# EAGLE design AnemometerTHT (EAGLE 9.6.2)

## Sheet 1 of 4: microcontroller
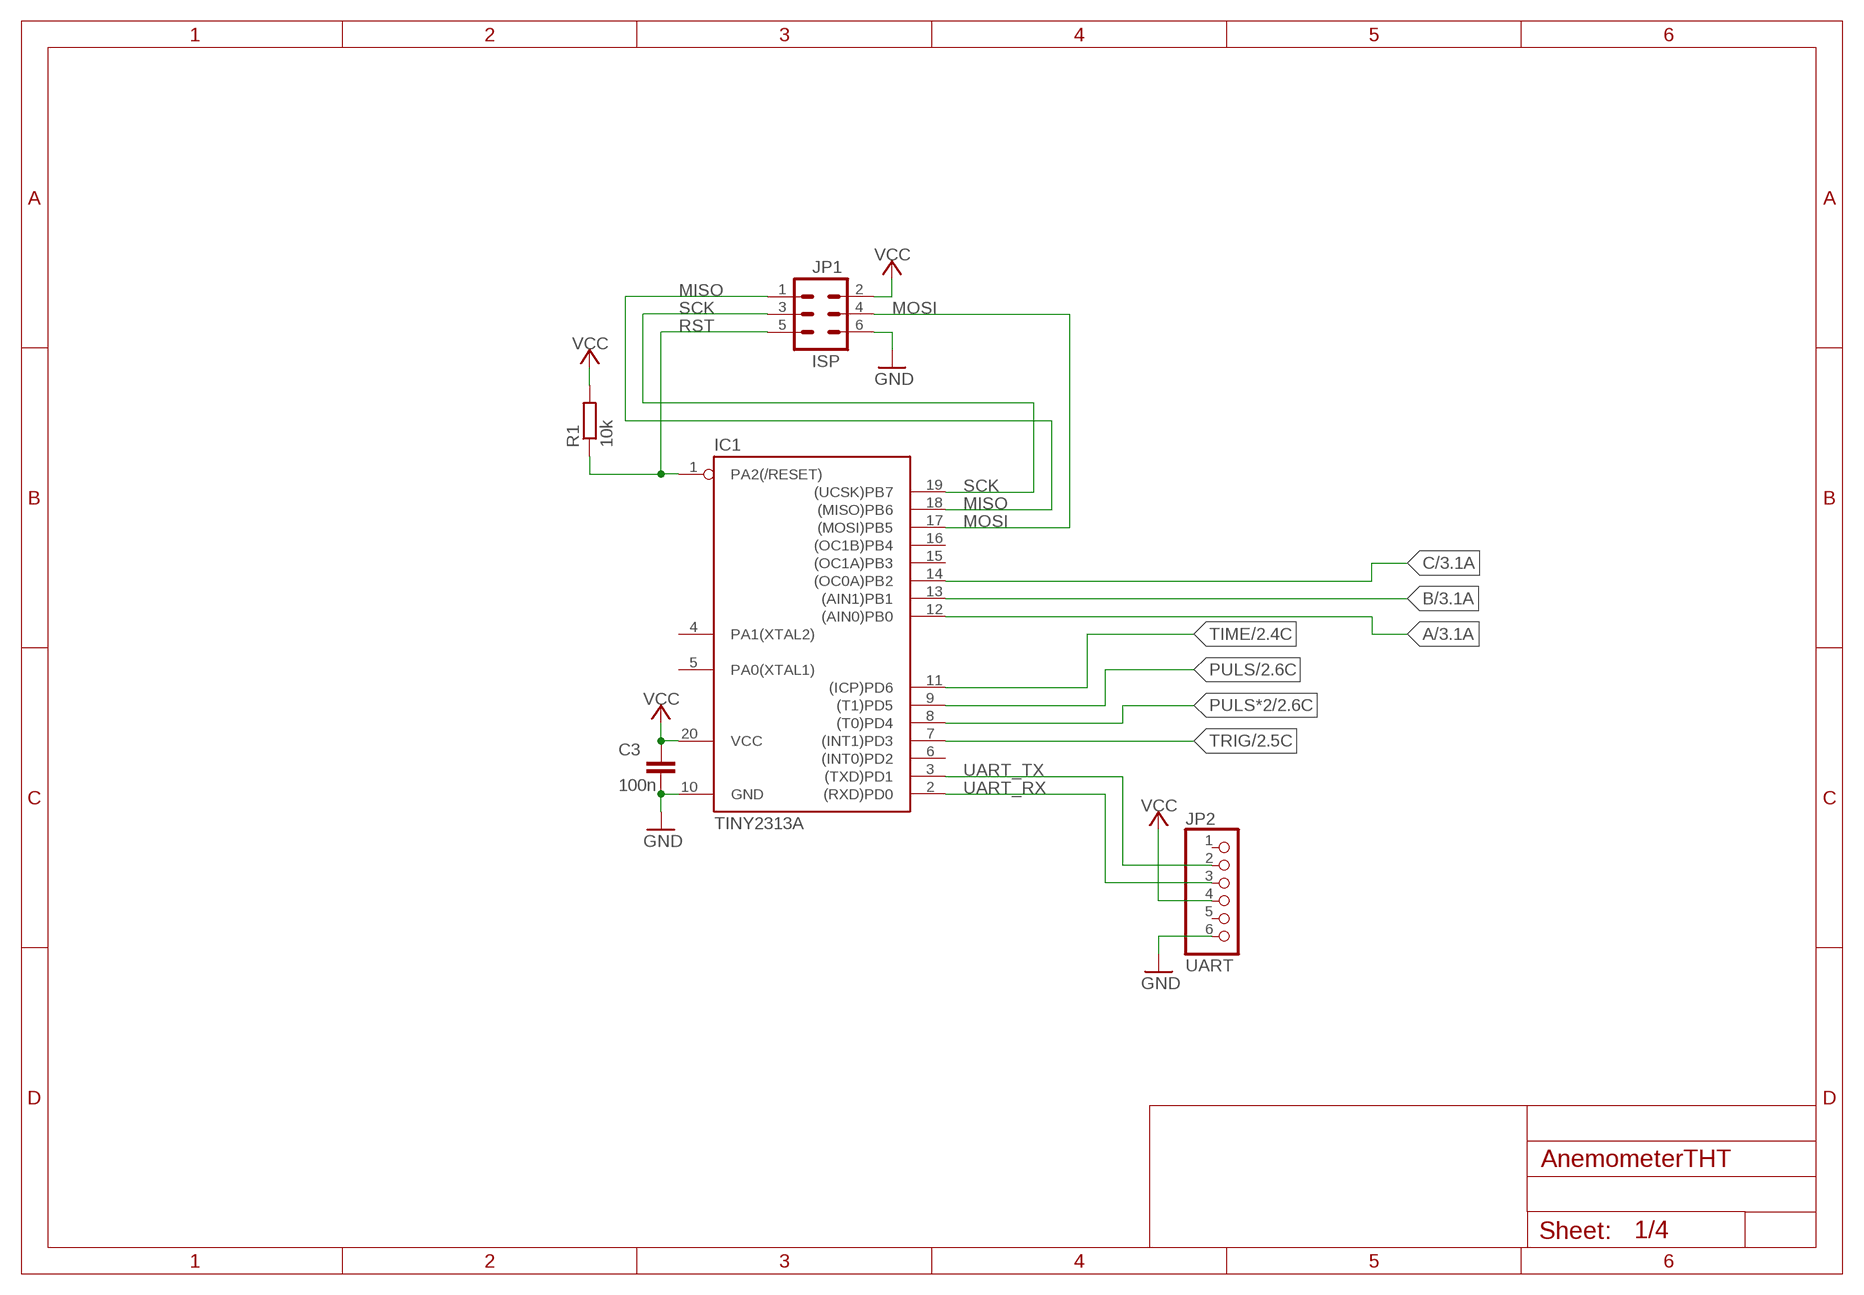
[diagram p0: schematic, sheet 1]

### Parts
C3  100n  C-EU050-030X075  [C050-030X075]
IC1  TINY2313A  TINY2313-*P*  [DIL20]
JP1  ISP  ML6  [ML6]
JP2  UART  PINHD-1X6  [1X06]
R1  10k  R-EU_0204/7  [0204/7]

### Nets
A: IC1.12((AIN0)PB0) ; also sheet 3
B: IC1.13((AIN1)PB1) ; also sheet 3
C: IC1.14((OC0A)PB2) ; also sheet 3
GND: C3.2 IC1.10(GND) JP1.6 JP2.6 ; also sheet 2,3,4
MISO: IC1.18((MISO)PB6) JP1.1
MOSI: IC1.17((MOSI)PB5) JP1.4
PULS: IC1.9((T1)PD5) ; also sheet 2
PULS*2: IC1.8((T0)PD4) ; also sheet 2
RST: IC1.1(PA2(/RESET)) JP1.5 R1.1
SCK: IC1.19((UCSK)PB7) JP1.3
TIME: IC1.11((ICP)PD6) ; also sheet 2
TRIG: IC1.7((INT1)PD3) ; also sheet 2,3
UART_RX: IC1.2((RXD)PD0) JP2.3
UART_TX: IC1.3((TXD)PD1) JP2.2
VCC: C3.1 IC1.20(VCC) JP1.2 JP2.4 R1.2 ; also sheet 2,3,4
Unconnected: IC1.4(PA1(XTAL2)) IC1.5(PA0(XTAL1)) IC1.6((INT0)PD2) IC1.15((OC1A)PB3) IC1.16((OC1B)PB4) JP2.1 JP2.5

## Sheet 2 of 4: puls generation
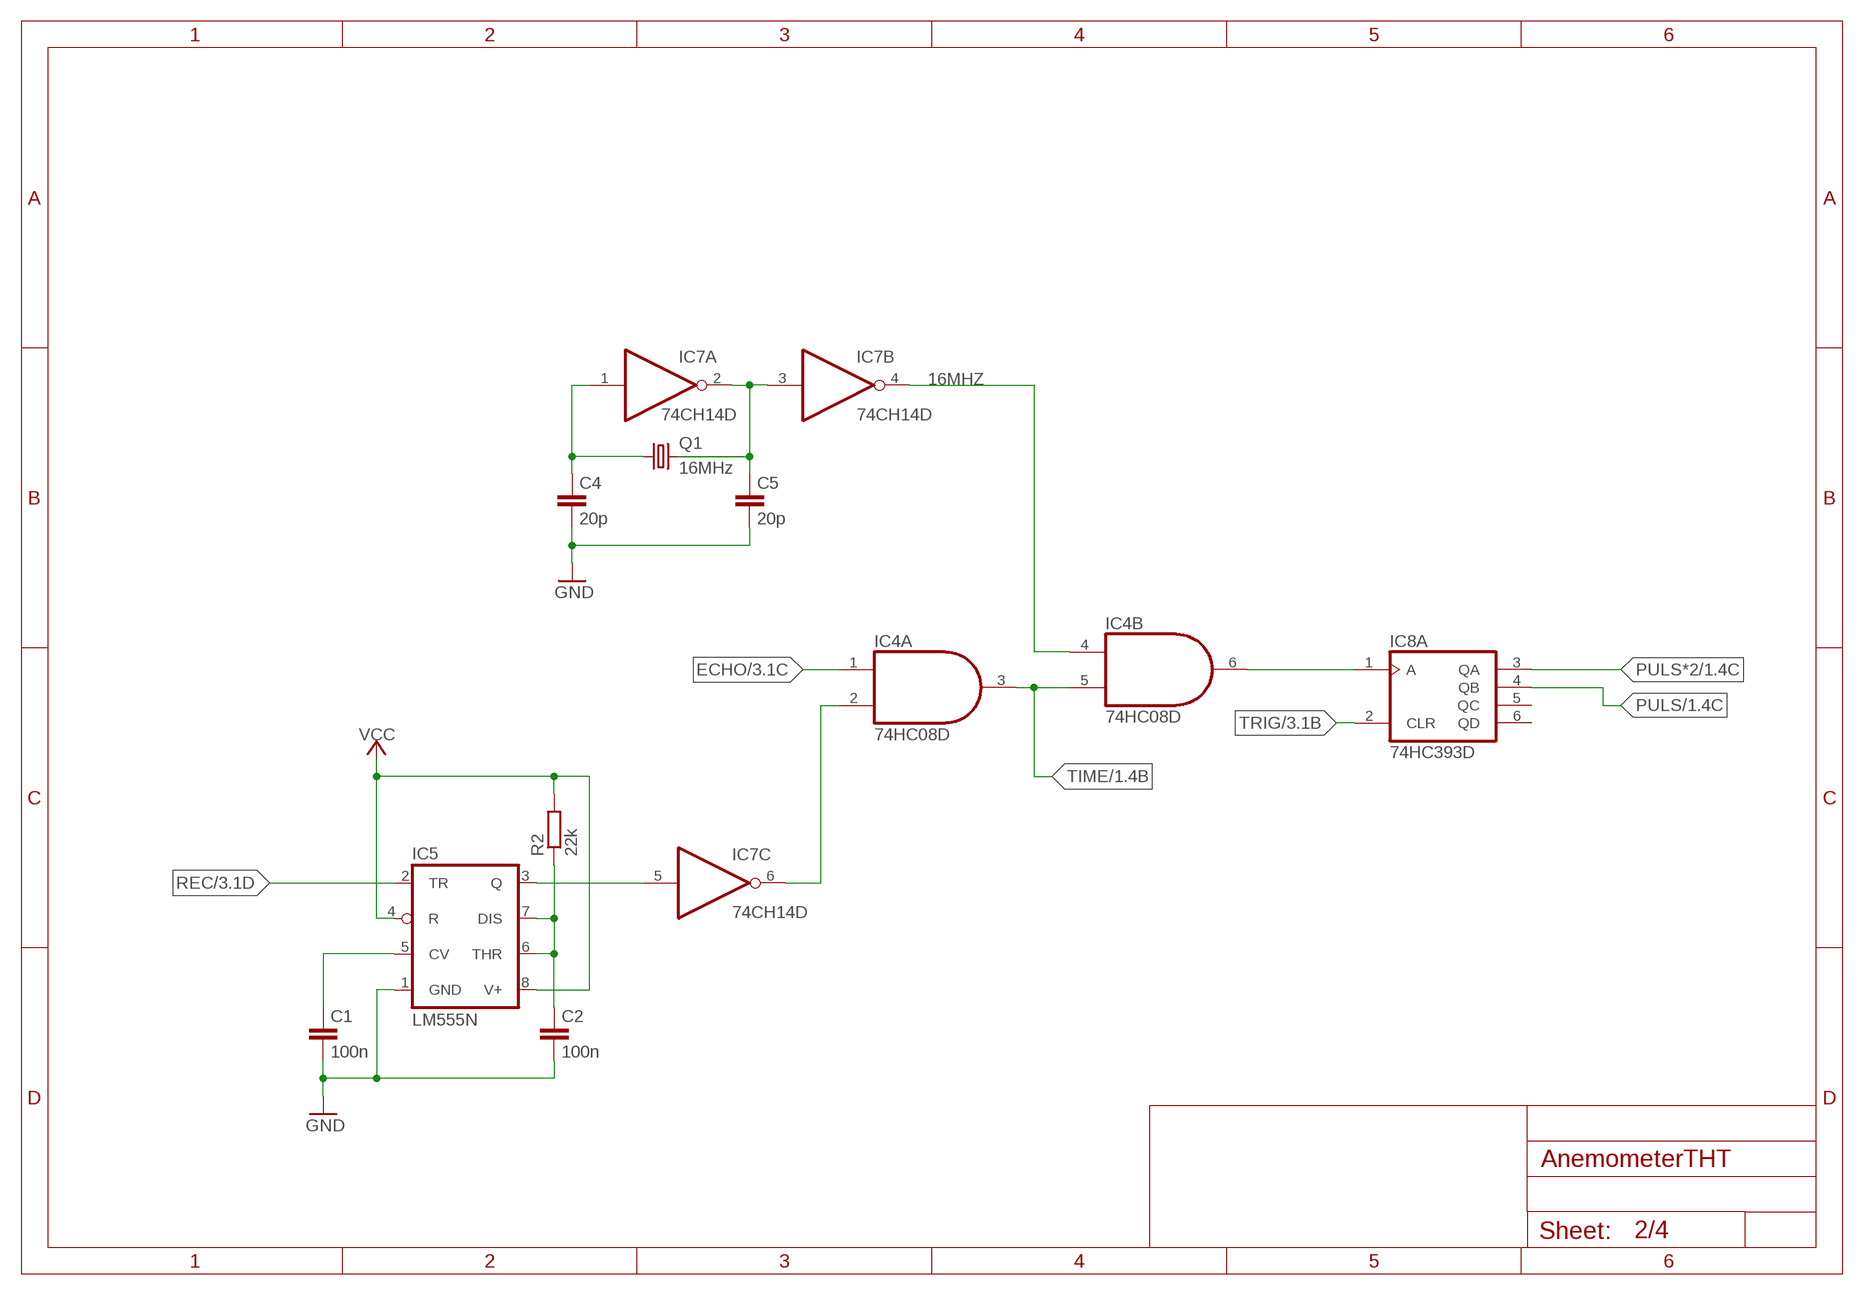
[diagram p1: schematic, sheet 2]

### Parts
C1  100n  C-EU050-030X075  [C050-030X075]
C2  100n  C-EU050-030X075  [C050-030X075]
C4  20p  C-EU050-030X075  [C050-030X075]
C5  20p  C-EU050-030X075  [C050-030X075]
IC4  74HC08D  74ALS08N  [DIL14]
IC5  LM555N  [DIL08]
IC7  74CH14D  74ALS04N  [DIL14]
IC8  74HC393D  74LS393N  [DIL14]
Q1  16MHz  CRYSTALHC49U70  [HC49U70]
R2  22k  R-EU_0204/7  [0204/7]

### Nets
16MHZ: IC4.4(B:I0) IC7.4(B:O)
ECHO: IC4.1(A:I0) ; also sheet 3
GND: C1.2 C2.2 C4.2 C5.2 IC5.1(GND) ; also sheet 1,3,4
N$1: IC5.3(Q) IC7.5(C:I)
N$2: C1.1 IC5.5(CV)
N$3: IC4.6(B:O) IC8.1(A:A)
N$4: C2.1 IC5.6(THR) IC5.7(DIS) R2.1
N$5: IC4.2(A:I1) IC7.6(C:O)
N$6: C4.1 IC7.1(A:I) Q1.1
N$7: C5.1 IC7.2(A:O) IC7.3(B:I) Q1.2
PULS: IC8.4(A:QB) ; also sheet 1
PULS*2: IC8.3(A:QA) ; also sheet 1
REC: IC5.2(TR) ; also sheet 3
TIME: IC4.3(A:O) IC4.5(B:I1) ; also sheet 1
TRIG: IC8.2(A:CLR) ; also sheet 1,3
VCC: IC5.4(R) IC5.8(V+) R2.2 ; also sheet 1,3,4
Unconnected: IC8.5(A:QC) IC8.6(A:QD)

## Sheet 3 of 4: multiplexer
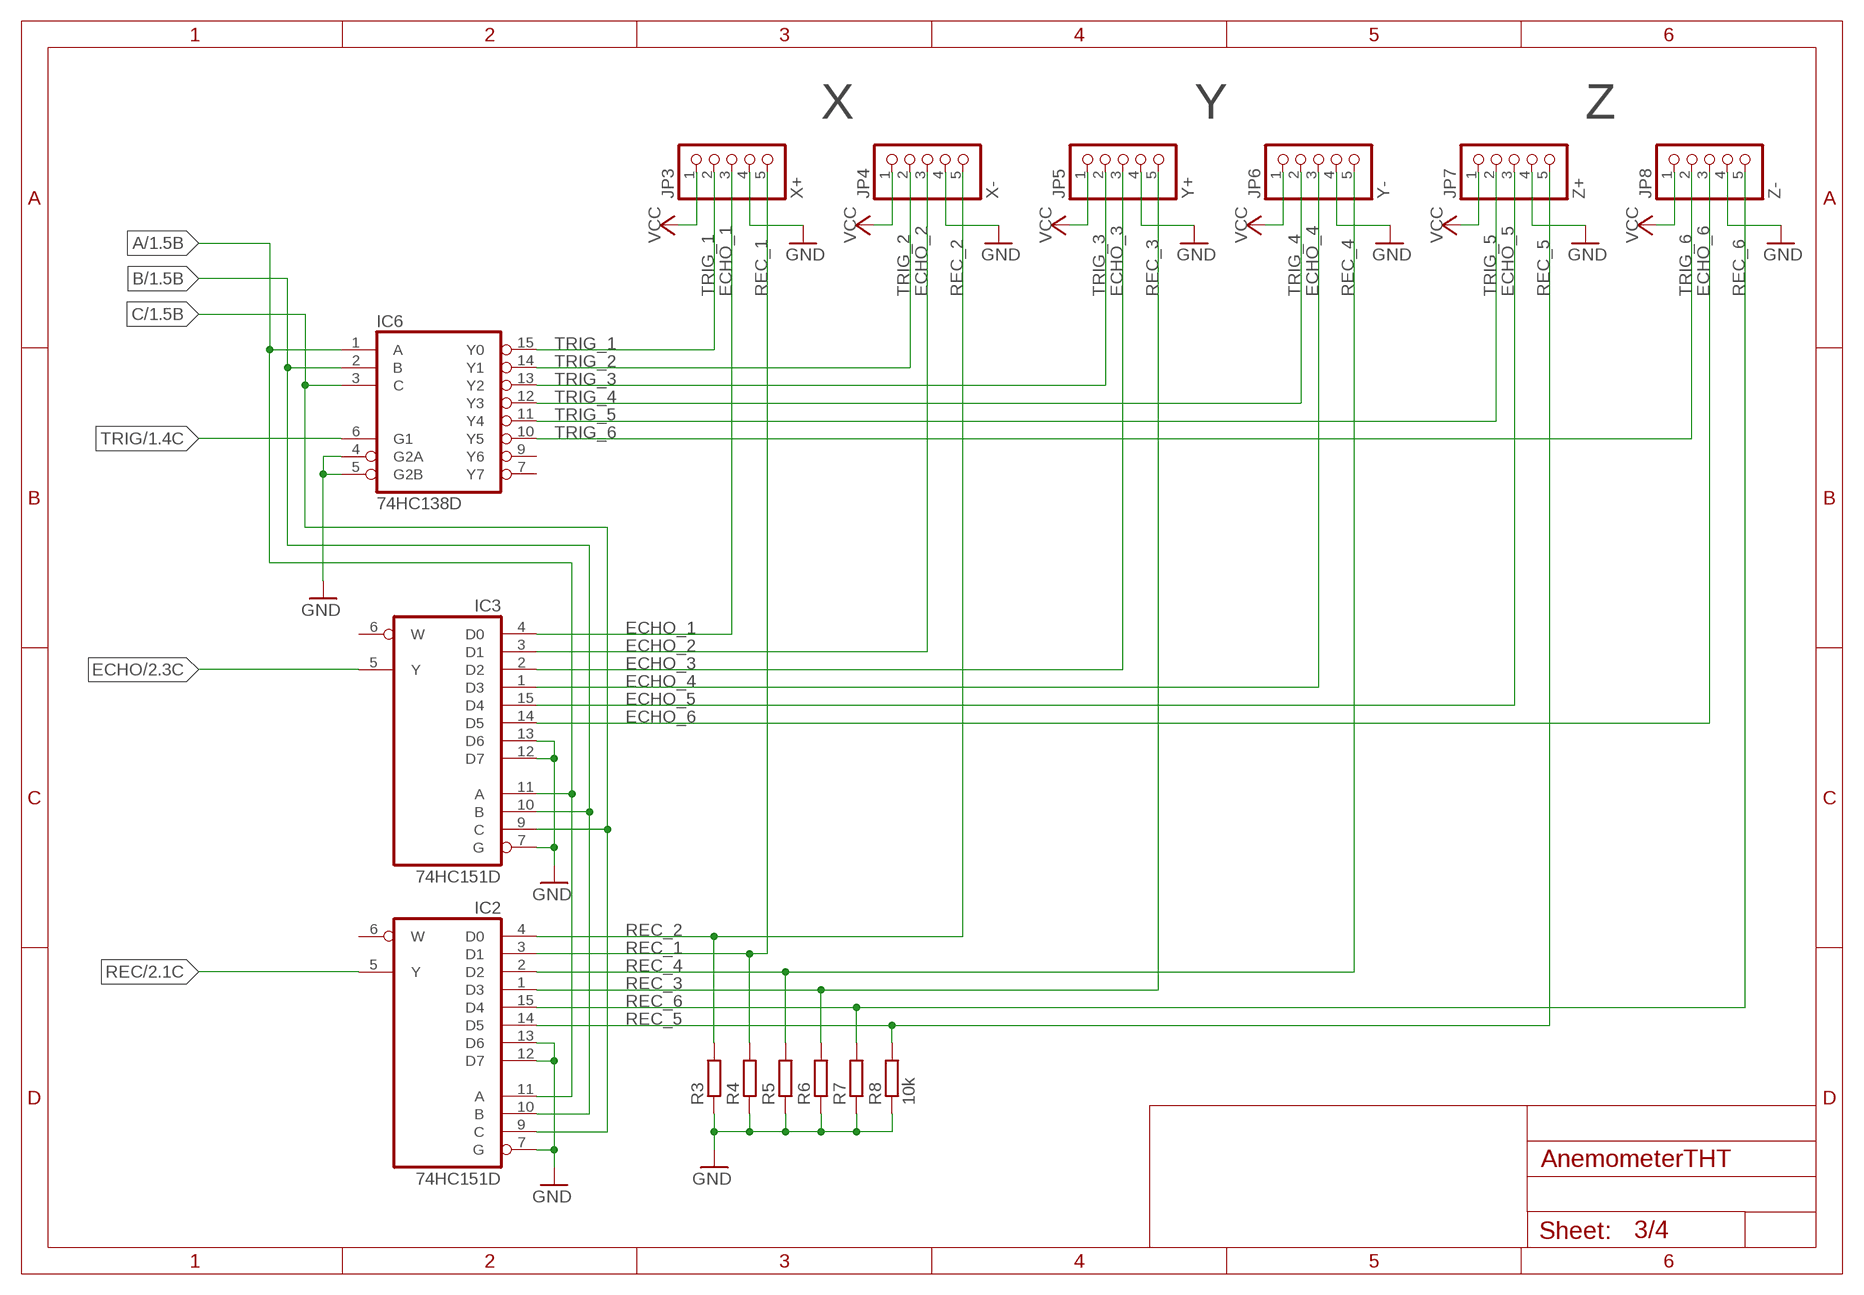
[diagram p2: schematic, sheet 3]

### Parts
IC2  74HC151D  74LS151N  [DIL16]
IC3  74HC151D  74LS151N  [DIL16]
IC6  74HC138D  74LS138N  [DIL16]
JP3  X+  PINHD-1X5  [1X05]
JP4  X-  PINHD-1X5  [1X05]
JP5  Y+  PINHD-1X5  [1X05]
JP6  Y-  PINHD-1X5  [1X05]
JP7  Z+  PINHD-1X5  [1X05]
JP8  Z-  PINHD-1X5  [1X05]
R3  10k  R-EU_0204/7  [0204/7]
R4  10k  R-EU_0204/7  [0204/7]
R5  10k  R-EU_0204/7  [0204/7]
R6  10k  R-EU_0204/7  [0204/7]
R7  10k  R-EU_0204/7  [0204/7]
R8  10k  R-EU_0204/7  [0204/7]

### Nets
A: IC2.11(A) IC3.11(A) IC6.1(A) ; also sheet 1
B: IC2.10(B) IC3.10(B) IC6.2(B) ; also sheet 1
C: IC2.9(C) IC3.9(C) IC6.3(C) ; also sheet 1
ECHO: IC3.5(Y) ; also sheet 2
ECHO_1: IC3.4(D0) JP3.3
ECHO_2: IC3.3(D1) JP4.3
ECHO_3: IC3.2(D2) JP5.3
ECHO_4: IC3.1(D3) JP6.3
ECHO_5: IC3.15(D4) JP7.3
ECHO_6: IC3.14(D5) JP8.3
GND: IC2.7(G) IC2.12(D7) IC2.13(D6) IC3.7(G) IC3.12(D7) IC3.13(D6) IC6.4(G2A) IC6.5(G2B) JP3.4 JP4.4 JP5.4 JP6.4 JP7.4 JP8.4 R3.1 R4.1 R5.1 R6.1 R7.1 R8.1 ; also sheet 1,2,4
REC: IC2.5(Y) ; also sheet 2
REC_1: IC2.3(D1) JP3.5 R4.2
REC_2: IC2.4(D0) JP4.5 R3.2
REC_3: IC2.1(D3) JP5.5 R6.2
REC_4: IC2.2(D2) JP6.5 R5.2
REC_5: IC2.14(D5) JP7.5 R8.2
REC_6: IC2.15(D4) JP8.5 R7.2
TRIG: IC6.6(G1) ; also sheet 1,2
TRIG_1: IC6.15(Y0) JP3.2
TRIG_2: IC6.14(Y1) JP4.2
TRIG_3: IC6.13(Y2) JP5.2
TRIG_4: IC6.12(Y3) JP6.2
TRIG_5: IC6.11(Y4) JP7.2
TRIG_6: IC6.10(Y5) JP8.2
VCC: JP3.1 JP4.1 JP5.1 JP6.1 JP7.1 JP8.1 ; also sheet 1,2,4
Unconnected: IC2.6(W) IC3.6(W) IC6.7(Y7) IC6.9(Y6)

### Notes on the sheet
- X | Y | Z

## Sheet 4 of 4: power / unused gates
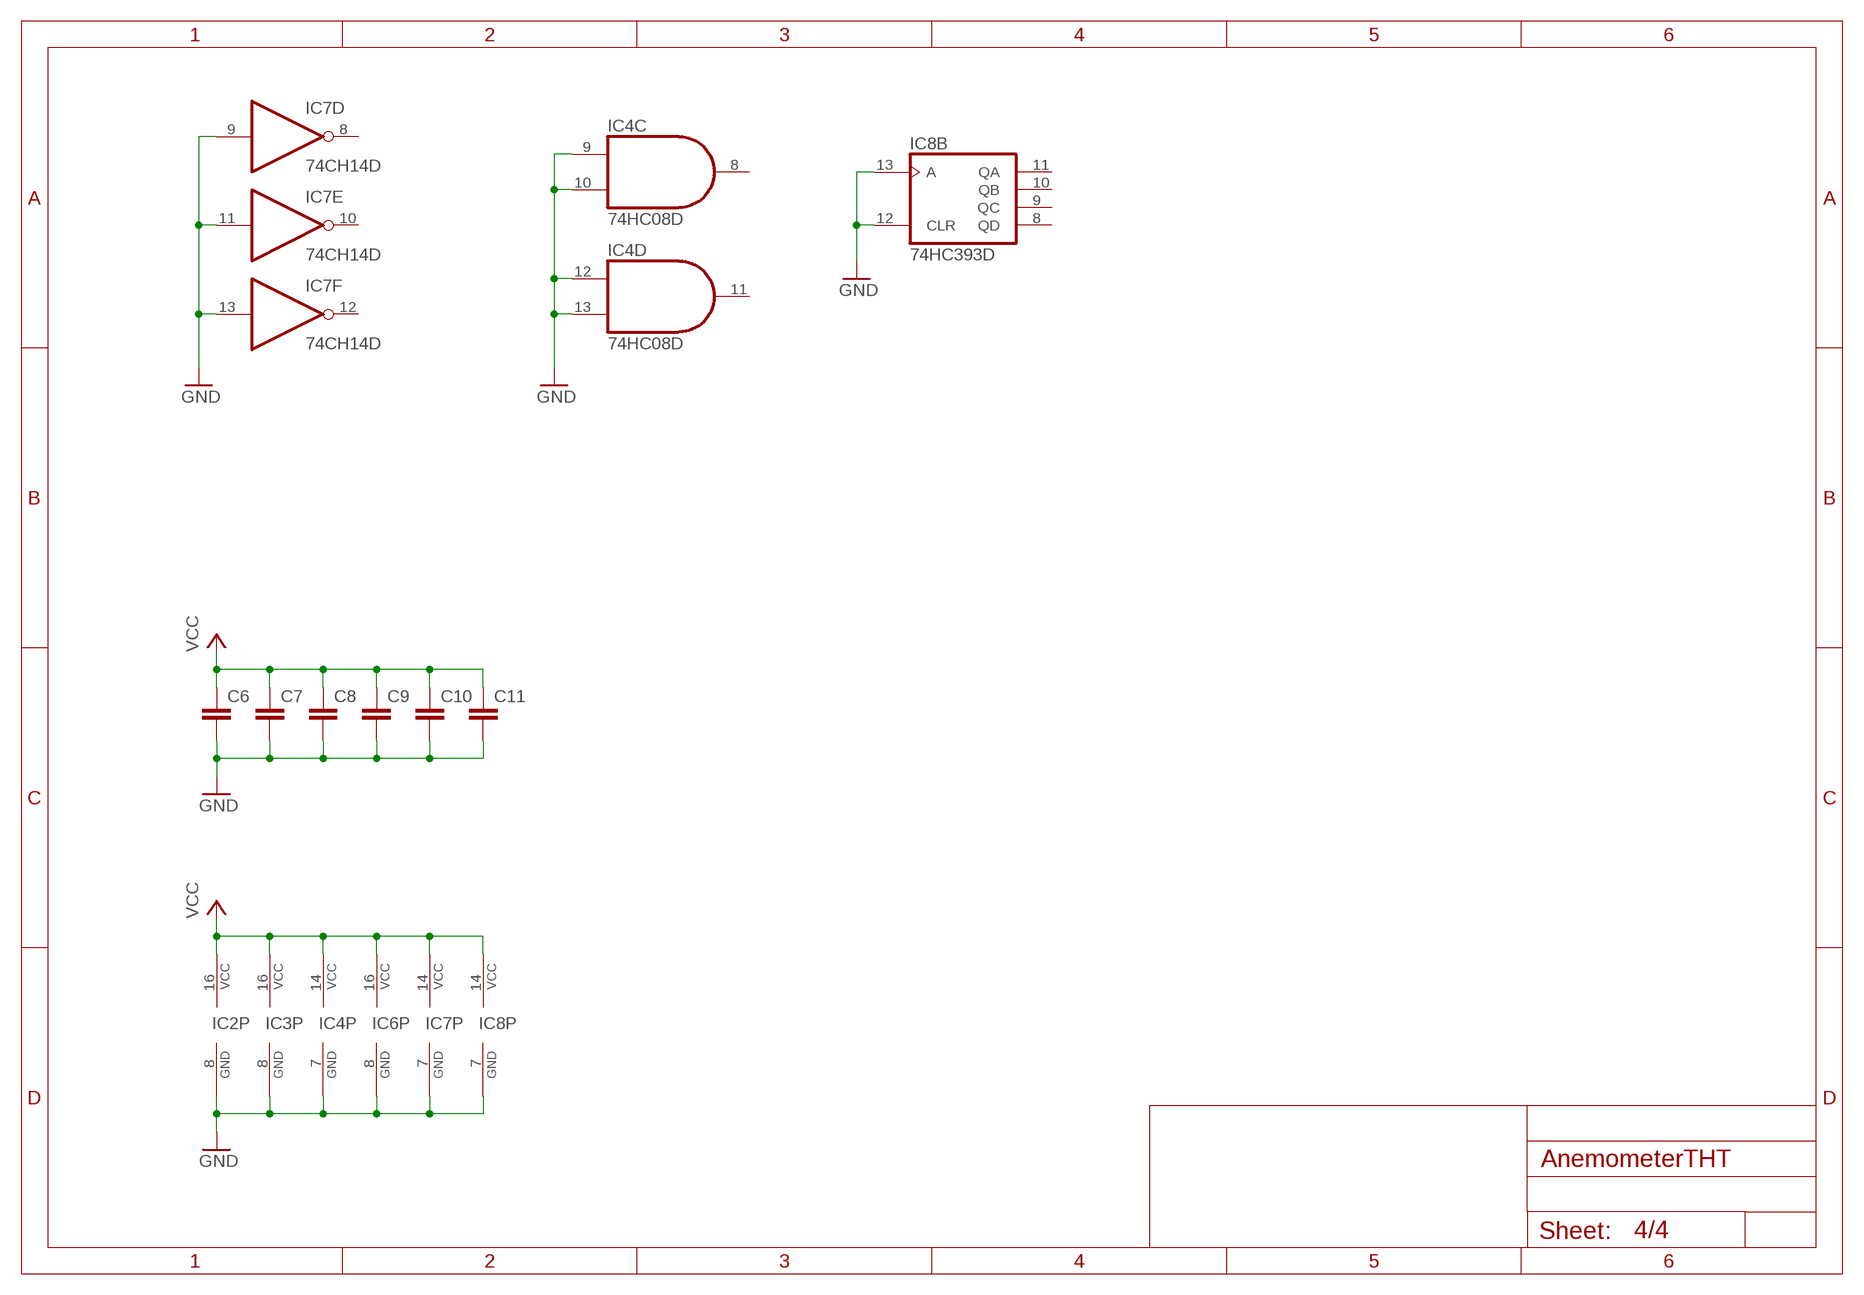
[diagram p3: schematic, sheet 4]

### Parts
C6  C-EU050-030X075  [C050-030X075]
C7  C-EU050-030X075  [C050-030X075]
C8  C-EU050-030X075  [C050-030X075]
C9  C-EU050-030X075  [C050-030X075]
C10  C-EU050-030X075  [C050-030X075]
C11  C-EU050-030X075  [C050-030X075]

### Nets
GND: C6.2 C7.2 C8.2 C9.2 C10.2 C11.2 IC2.8(GND) IC3.8(GND) IC4.7(P:GND) IC4.9(C:I0) IC4.10(C:I1) IC4.12(D:I0) IC4.13(D:I1) IC6.8(GND) IC7.7(P:GND) IC7.9(D:I) IC7.11(E:I) IC7.13(F:I) IC8.7(P:GND) IC8.12(B:CLR) IC8.13(B:A) ; also sheet 1,2,3
VCC: C6.1 C7.1 C8.1 C9.1 C10.1 C11.1 IC2.16(VCC) IC3.16(VCC) IC4.14(P:VCC) IC6.16(VCC) IC7.14(P:VCC) IC8.14(P:VCC) ; also sheet 1,2,3
Unconnected: IC4.8(C:O) IC4.11(D:O) IC7.8(D:O) IC7.10(E:O) IC7.12(F:O) IC8.8(B:QD) IC8.9(B:QC) IC8.10(B:QB) IC8.11(B:QA)

## Library data of the parts
C1-C11 = rcl:C-EU: CAPACITOR, European symbol; SPICEPREFIX: C
IC1 = avr-7:TINY2313*: Atmel Tiny2313 2K Flash, 128 bytes EEPROM, 128 bytes RAM
IC2 IC3 = 74xx-us:74*151: Data SELECTOR/MULTIPLEXER
IC4 = 74xx-us:74*08: Quad 2-input AND gate
IC5 = linear:*555: TIMER
IC6 = 74xx-us:74*138: 3-line to 8-line DECODER/DEMULTIPLEXER
IC7 = 74xx-us:74*04: Hex INVERTER
IC8 = 74xx-us:74*393: Dual 4-bit decade and binary COUNTER
JP1 = con-harting-ml:ML6: HARTING; OC_FARNELL: unknown; OC_NEWARK: unknown
JP2 = pinhead:PINHD-1X6: PIN HEADER
JP3-JP8 = pinhead:PINHD-1X5: PIN HEADER
Q1 = crystal:CRYSTAL: CRYSTAL; OC_FARNELL: unknown; OC_NEWARK: unknown
R1-R8 = rcl:R-EU_: RESISTOR, European symbol; SPICEPREFIX: R

## Board
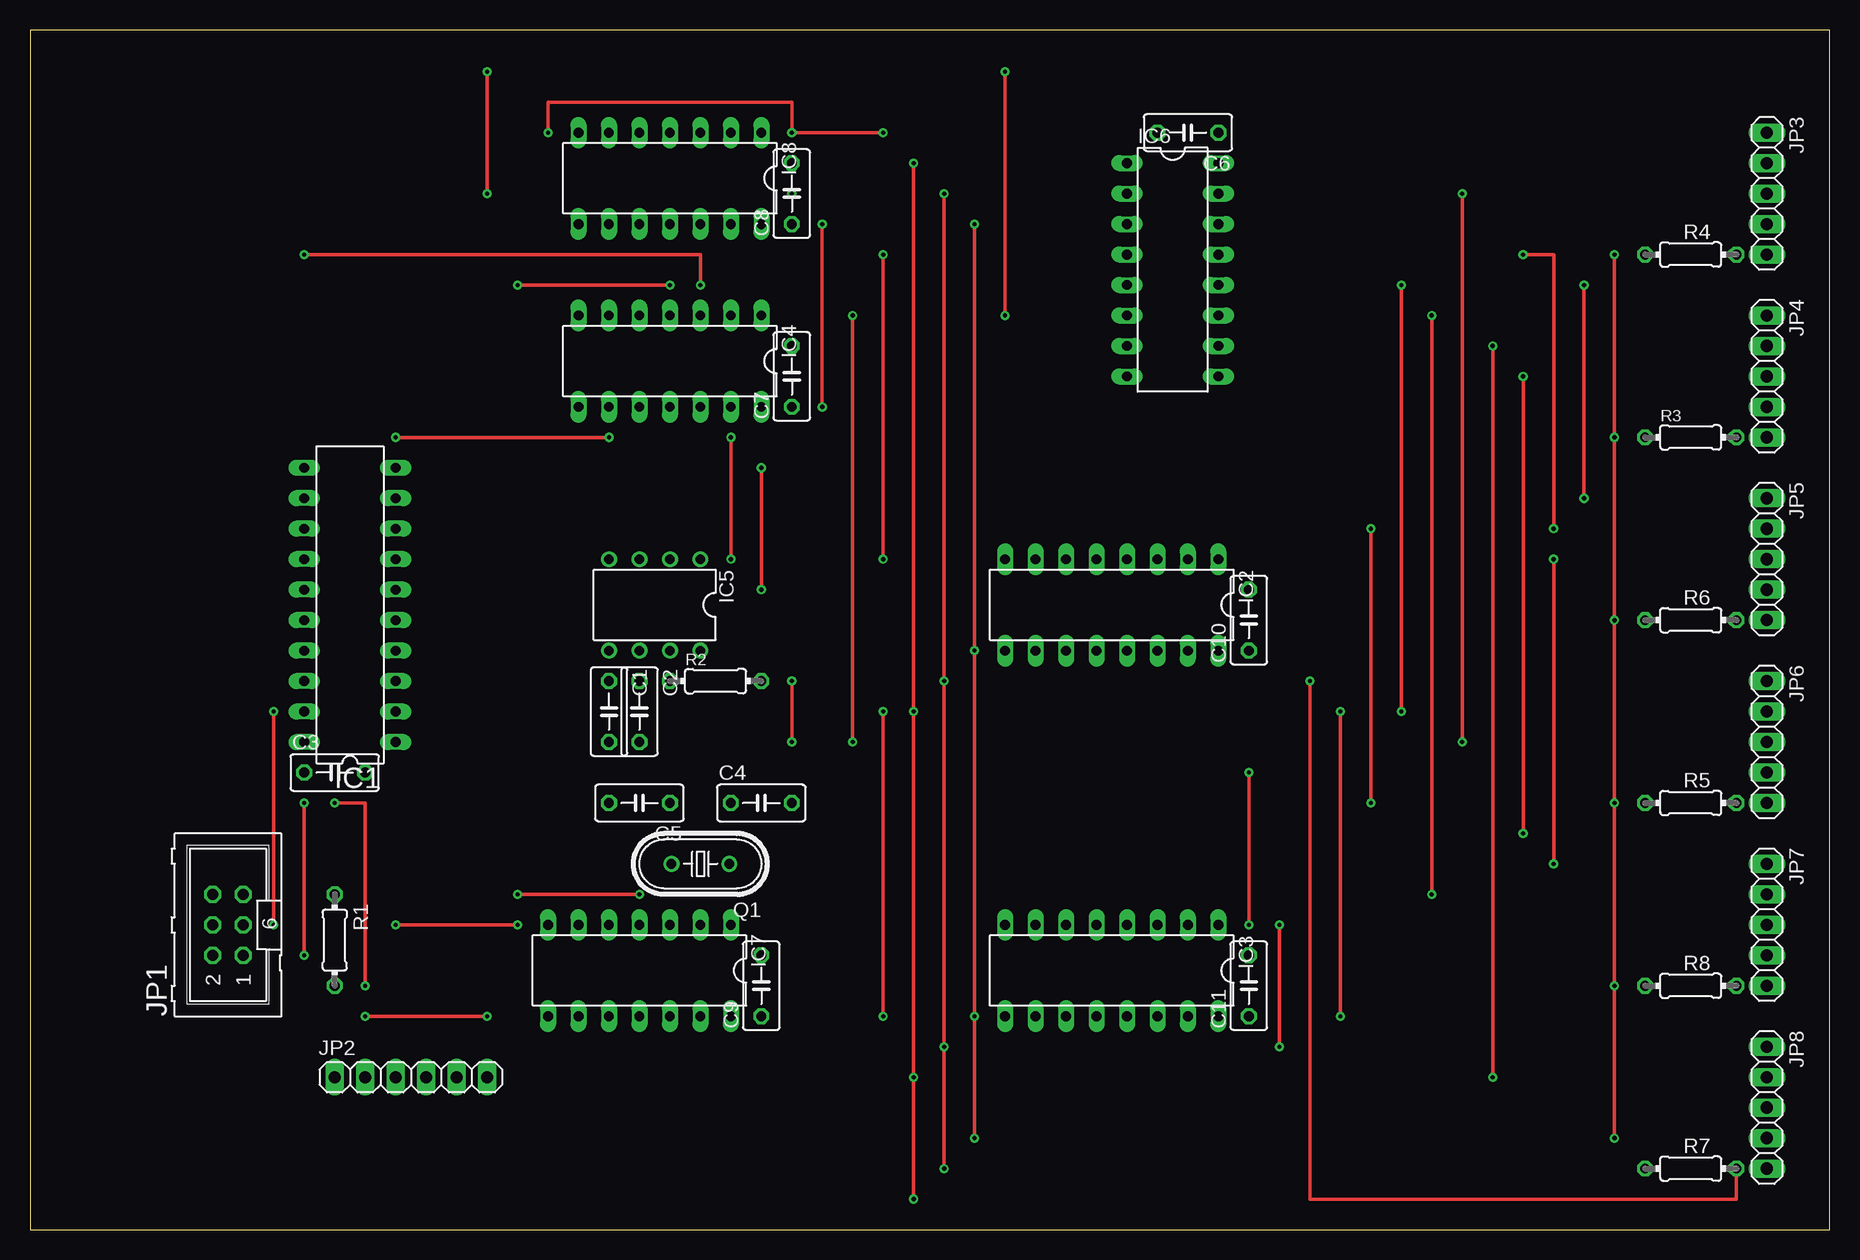
[diagram p4: board, top side]
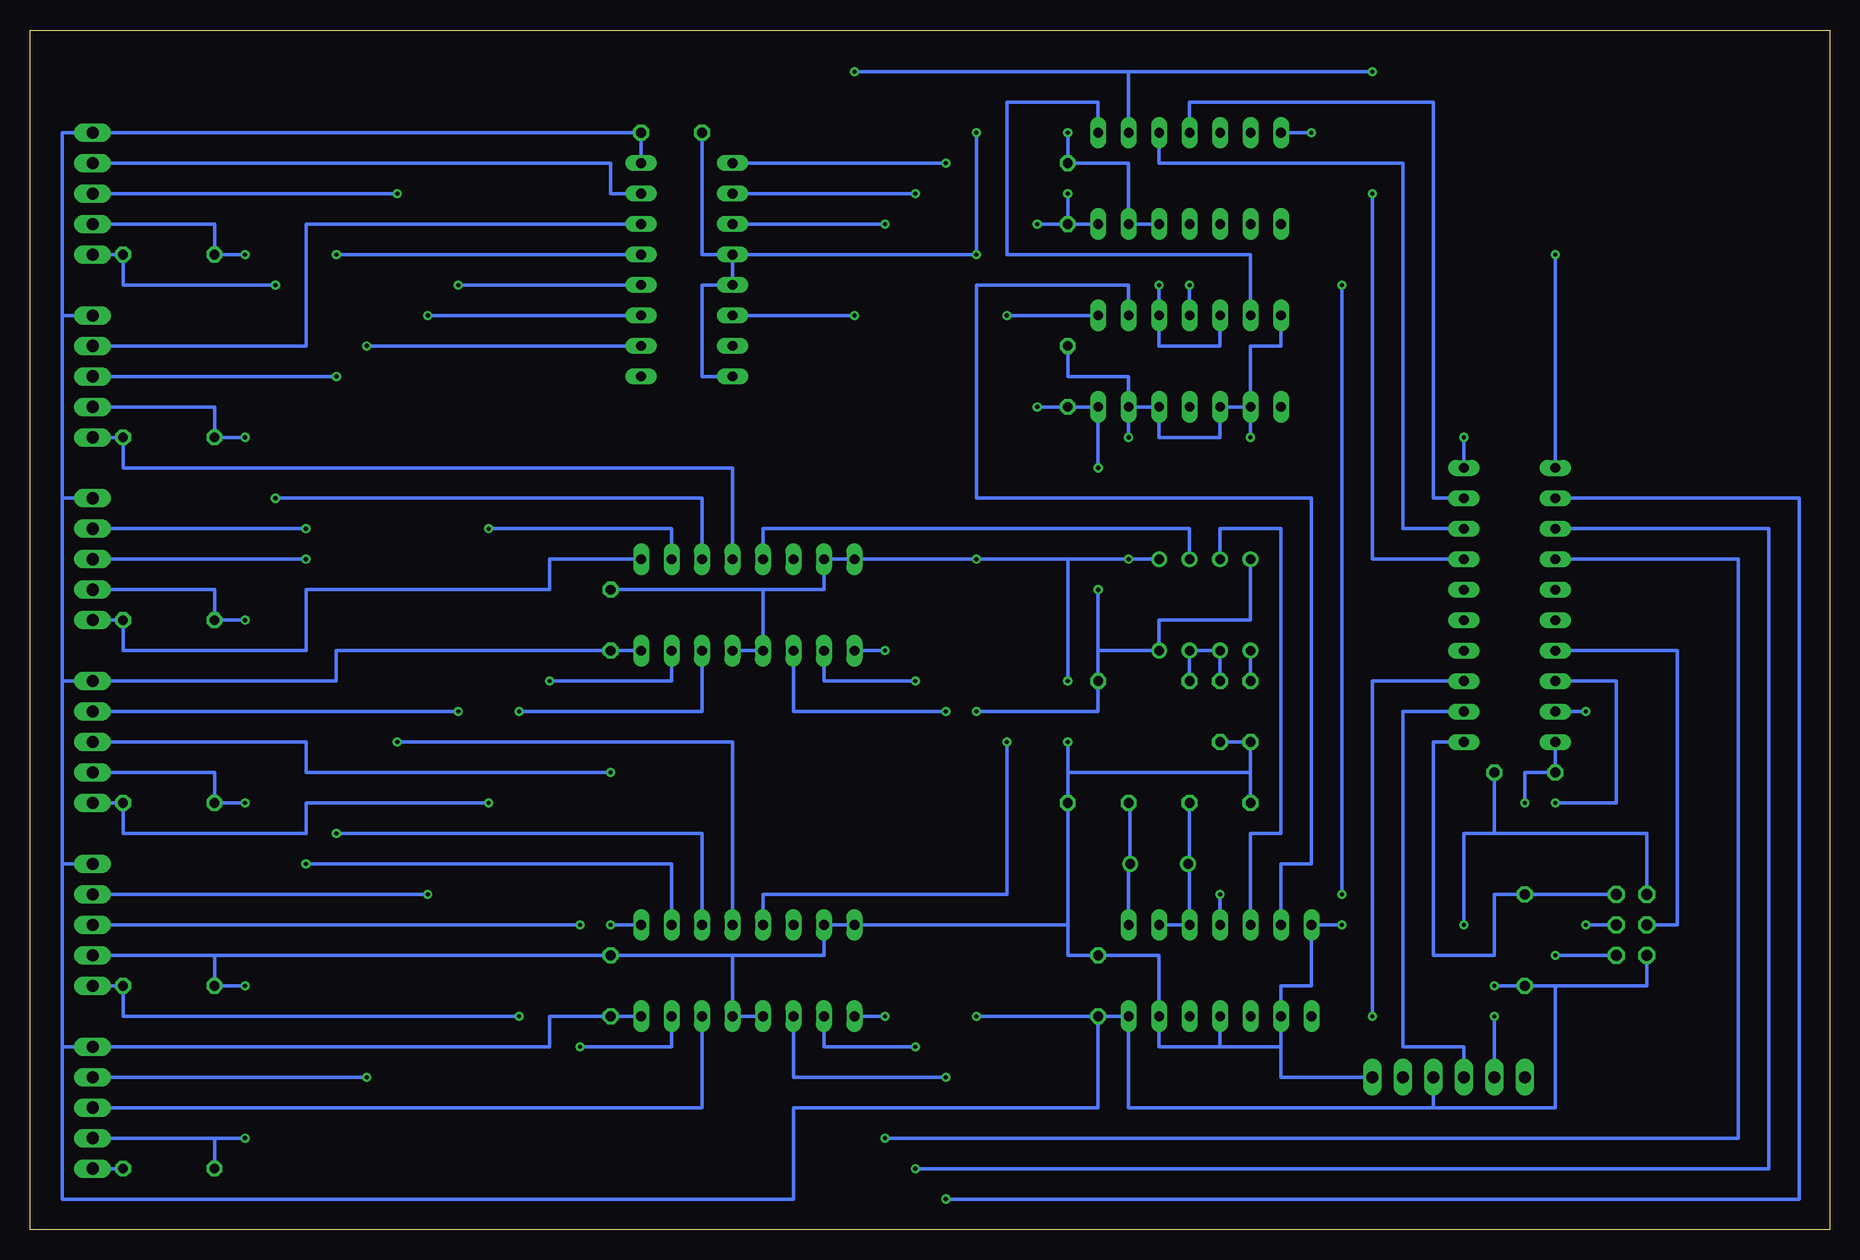
[diagram p5: board, bottom side, seen from below]

Size 150 x 100 mm. Coordinates in mm from the lower left corner, seen from the top.
Outline: 0,0 150,0 150,100 0,100 0,0
Copper layers (1*16): Top 0.035mm / dielectric 1.5mm / Bottom 0.035mm
Design rules "default": minimum track width 6mil, minimum drill 0.35mm, track to track 6mil, track to pad 6mil, pad to pad 6mil, via to via 6mil, smd to smd 6mil, copper to edge 40mil, drill to drill 6mil, minimum pad ring 10mil, minimum via ring 8mil, stop-mask expansion 4mil, vias tented up to drill 0mil, thermal gap 10mil

### Footprints (pad centres in the part's own frame; a part is rotated, then mirrored left to right if it is on the bottom)
C050-030X075 = drill 0.813 octagon: 1 -2.54,0; 2 2.54,0
DIL20 = drill 0.813 long: 1 -11.43,-3.81; 2 -8.89,-3.81; 3 -6.35,-3.81; 4 -3.81,-3.81; 5 -1.27,-3.81; 6 1.27,-3.81; 7 3.81,-3.81; 8 6.35,-3.81; 9 8.89,-3.81; 10 11.43,-3.81; 11 11.43,3.81; 12 8.89,3.81; 13 6.35,3.81; 14 3.81,3.81; 15 1.27,3.81; 16 -1.27,3.81; 17 -3.81,3.81; 18 -6.35,3.81; 19 -8.89,3.81; 20 -11.43,3.81
DIL16 = drill 0.813 long: 1 -8.89,-3.81; 2 -6.35,-3.81; 3 -3.81,-3.81; 4 -1.27,-3.81; 5 1.27,-3.81; 6 3.81,-3.81; 7 6.35,-3.81; 8 8.89,-3.81; 9 8.89,3.81; 10 6.35,3.81; 11 3.81,3.81; 12 1.27,3.81; 13 -1.27,3.81; 14 -3.81,3.81; 15 -6.35,3.81; 16 -8.89,3.81
DIL14 = drill 0.813 long: 1 -7.62,-3.81; 2 -5.08,-3.81; 3 -2.54,-3.81; 4 0,-3.81; 5 2.54,-3.81; 6 5.08,-3.81; 7 7.62,-3.81; 8 7.62,3.81; 9 5.08,3.81; 10 2.54,3.81; 11 0,3.81; 12 -2.54,3.81; 13 -5.08,3.81; 14 -7.62,3.81
DIL08 = drill 0.813 pad 1.27: 1 -3.81,-3.81; 2 -1.27,-3.81; 3 1.27,-3.81; 4 3.81,-3.81; 5 3.81,3.81; 6 1.27,3.81; 7 -1.27,3.81; 8 -3.81,3.81
ML6 = drill 0.914 octagon: 1 -2.54,-1.27; 2 -2.54,1.27; 3 0,-1.27; 4 0,1.27; 5 2.54,-1.27; 6 2.54,1.27
1X06 = drill 1.016 long: 1 -6.35,0; 2 -3.81,0; 3 -1.27,0; 4 1.27,0; 5 3.81,0; 6 6.35,0
1X05 = drill 1.016 long: 1 -5.08,0; 2 -2.54,0; 3 0,0; 4 2.54,0; 5 5.08,0
HC49U70 = drill 0.813: 1 -2.413,0; 2 2.413,0
0204/7 = drill 0.813 octagon: 1 -3.81,0; 2 3.81,0

### Placement (x,y rotation side)
C1  48.26,43.18 270 top
C2  50.8,43.18 270 top
C3  25.4,38.1 0 top
C4  60.96,35.56 0 top
C5  50.8,35.56 180 top
C6  96.52,91.44 180 top
C7  63.5,71.12 90 top
C8  63.5,86.36 90 top
C9  60.96,20.32 90 top
C10  101.6,50.8 90 top
C11  101.6,20.32 90 top
IC1  26.67,52.07 90 top
IC2  90.17,52.07 180 top
IC3  90.17,21.59 180 top
IC4  53.34,72.39 180 top
IC5  52.07,52.07 180 top
IC6  95.25,80.01 270 top
IC7  50.8,21.59 180 top
IC8  53.34,87.63 180 top
JP1  16.51,25.4 90 top
JP2  31.75,12.7 0 top
JP3  144.78,86.36 270 top
JP4  144.78,71.12 270 top
JP5  144.78,55.88 270 top
JP6  144.78,40.64 270 top
JP7  144.78,25.4 270 top
JP8  144.78,10.16 270 top
Q1  55.88,30.48 180 top
R1  25.4,24.13 270 top
R2  57.15,45.72 0 top
R3  138.43,66.04 0 top
R4  138.43,81.28 0 top
R5  138.43,35.56 0 top
R6  138.43,50.8 0 top
R7  138.43,5.08 0 top
R8  138.43,20.32 0 top

### Tracks (layer width: path | path; a pad name or v marks a point on that pad's centre or on a via)
16MHZ  (via drill 0.35)
  Top 0.305: v50.8,27.94 v40.64,27.94 | v40.64,78.74 v53.34,78.74
  Bottom 0.305: IC7.4 v50.8,27.94 | v53.34,78.74 IC4.4 | v40.64,27.94 v40.64,78.74
A  (via drill 0.35)
  Top 0.305: v73.66,88.9 v73.66,43.18 v73.66,12.7 v73.66,2.54
  Bottom 0.305: IC2.11 86.36,43.18 v73.66,43.18 | v73.66,12.7 86.36,12.7 IC3.11 | v73.66,88.9 IC6.1 | IC1.12 2.54,60.96 2.54,2.54 v73.66,2.54
B  (via drill 0.35)
  Top 0.305: v76.2,86.36 v76.2,45.72 v76.2,15.24 v76.2,5.08
  Bottom 0.305: IC3.10 83.82,15.24 v76.2,15.24 | v76.2,45.72 83.82,45.72 IC2.10 | IC6.2 v76.2,86.36 | IC1.13 5.08,58.42 5.08,5.08 v76.2,5.08
C  (via drill 0.35)
  Top 0.305: v78.74,83.82 v78.74,48.26 v78.74,17.78 v78.74,7.62
  Bottom 0.305: IC3.9 v78.74,17.78 | v78.74,48.26 IC2.9 | v78.74,83.82 IC6.3 | IC1.14 7.62,55.88 7.62,7.62 v78.74,7.62
ECHO  (via drill 0.35)
  Top 0.305: v68.58,76.2 v68.58,40.64
  Bottom 0.305: IC4.1 v68.58,76.2 | IC3.5 88.9,27.94 68.58,27.94 v68.58,40.64
ECHO_1  (via drill 0.35)
  Top 0.305: v119.38,86.36 v119.38,40.64
  Bottom 0.305: IC3.4 91.44,40.64 v119.38,40.64 | v119.38,86.36 JP3.3
ECHO_2  (via drill 0.35)
  Top 0.305: v124.46,33.02 v124.46,71.12
  Bottom 0.305: IC3.3 93.98,33.02 v124.46,33.02 | JP4.3 v124.46,71.12
ECHO_3  (via drill 0.35)
  Top 0.305: v127,55.88 v127,30.48
  Bottom 0.305: v127,30.48 96.52,30.48 IC3.2 | JP5.3 v127,55.88
ECHO_4  (via drill 0.35)
  Top 0.305: v101.6,38.1 v101.6,25.4
  Bottom 0.305: JP6.3 127,40.64 127,38.1 v101.6,38.1 | IC3.1 v101.6,25.4
ECHO_5  (via drill 0.35)
  Top 0.305: v104.14,25.4 v104.14,15.24
  Bottom 0.305: v104.14,15.24 96.52,15.24 IC3.15 | v104.14,25.4 JP7.3
ECHO_6
  Bottom 0.305: JP8.3 93.98,10.16 IC3.14
GND  (via drill 0.35)
  Top 0.305: v43.18,91.44 43.18,93.98 63.5,93.98 v63.5,91.44 v71.12,91.44 | v40.64,25.4 v30.48,25.4 | v58.42,55.88 v58.42,66.04 | v132.08,7.62 v132.08,20.32 v132.08,35.56 v132.08,50.8 v132.08,66.04 v132.08,81.28 | v71.12,81.28 v71.12,55.88 | v30.48,66.04 v48.26,66.04 | v63.5,40.64 v63.5,45.72
  Bottom 0.305: JP1.6 15.24,33.02 27.94,33.02 | 27.94,33.02 C3.2 | IC8.12 IC8.13 58.42,88.9 C8.2 v63.5,91.44 | IC8.7 v43.18,91.44 | JP2.6 45.72,12.7 45.72,15.24 | 45.72,15.24 IC7.9 45.72,20.32 43.18,20.32 IC7.7 v40.64,25.4 | 50.8,15.24 55.88,15.24 IC7.13 55.88,22.86 C9.2 63.5,22.86 63.5,25.4 | 50.8,15.24 45.72,15.24 | IC7.11 50.8,15.24 | v30.48,25.4 30.48,33.02 27.94,33.02 | C5.2 48.26,38.1 | 48.26,38.1 C1.2 C2.2 | 63.5,38.1 C4.2 63.5,25.4 | 48.26,38.1 63.5,38.1 | IC3.12 IC3.13 91.44,22.86 | IC2.13 IC2.12 88.9,53.34 | 63.5,25.4 IC3.8 IC3.7 83.82,22.86 91.44,22.86 | IC5.1 v58.42,55.88 63.5,55.88 | 63.5,55.88 v71.12,55.88 IC2.8 IC2.7 83.82,53.34 88.9,53.34 | IC4.9 IC4.10 50.8,66.04 55.88,66.04 IC4.12 IC4.13 | v58.42,66.04 IC4.13 | IC4.13 58.42,71.12 63.5,71.12 C7.2 | v71.12,91.44 v71.12,81.28 IC6.4 | R7.1 134.62,7.62 | JP8.4 134.62,7.62 | 134.62,22.86 R8.1 v132.08,20.32 | 134.62,22.86 JP7.4 | JP6.4 134.62,38.1 R5.1 v132.08,35.56 | JP5.4 134.62,53.34 R6.1 v132.08,50.8 | JP4.4 134.62,68.58 R3.1 v132.08,66.04 | JP3.4 134.62,83.82 R4.1 v132.08,81.28 | IC6.4 IC6.5 93.98,78.74 93.98,71.12 IC6.8 | C6.2 93.98,81.28 IC6.4 | C10.2 88.9,53.34 | 91.44,22.86 C11.2 134.62,22.86 | 134.62,7.62 v132.08,7.62 | IC1.10 v30.48,66.04 | v48.26,66.04 IC4.9 | IC4.9 48.26,73.66 45.72,73.66 IC4.7 | 63.5,38.1 v63.5,40.64 | v63.5,45.72 63.5,55.88
MISO  (via drill 0.35)
  Top 0.305: v22.86,22.86 v22.86,35.56
  Bottom 0.305: JP1.1 v22.86,22.86 | v22.86,35.56 17.78,35.56 17.78,45.72 IC1.18
MOSI
  Bottom 0.305: JP1.4 12.7,25.4 12.7,48.26 IC1.17
N$1
  Bottom 0.305: IC5.3 50.8,58.42 45.72,58.42 45.72,33.02 48.26,33.02 IC7.5
N$2
  Bottom 0.305: C1.1 IC5.5
N$3
  Bottom 0.305: IC8.1 60.96,93.98 68.58,93.98 68.58,81.28 48.26,81.28 IC4.6
N$4
  Bottom 0.305: C2.1 IC5.6 IC5.7 R2.1
N$5
  Bottom 0.305: IC7.6 45.72,30.48 43.18,30.48 43.18,60.96 71.12,60.96 71.12,78.74 58.42,78.74 IC4.2
N$6
  Bottom 0.305: IC7.1 58.42,30.48 Q1.1 58.29,35.56 C4.1
N$7
  Bottom 0.305: 53.34,30.48 IC7.3 IC7.2 | Q1.2 53.34,30.48 | 53.34,30.48 C5.1
PULS
  Bottom 0.305: IC1.9 33.02,60.96 33.02,93.98 53.34,93.98 IC8.4
PULS*2
  Bottom 0.305: IC1.8 35.56,58.42 35.56,88.9 55.88,88.9 IC8.3
REC
  Bottom 0.305: IC5.2 53.34,58.42 88.9,58.42 IC2.5
REC_1  (via drill 0.35)
  Top 0.305: v129.54,78.74 v129.54,60.96
  Bottom 0.305: JP3.5 R4.2 142.24,78.74 v129.54,78.74 | v129.54,60.96 93.98,60.96 IC2.3
REC_2
  Bottom 0.305: JP4.5 R3.2 142.24,63.5 91.44,63.5 IC2.4
REC_3
  Bottom 0.305: JP5.5 R6.2 142.24,48.26 127,48.26 127,53.34 106.68,53.34 106.68,55.88 IC2.1
REC_4  (via drill 0.35)
  Top 0.305: v111.76,58.42 v111.76,35.56
  Bottom 0.305: JP6.5 R5.2 142.24,33.02 127,33.02 127,35.56 v111.76,35.56 | IC2.2 96.52,58.42 v111.76,58.42
REC_5  (via drill 0.35)
  Top 0.305: v109.22,17.78 v109.22,43.18
  Bottom 0.305: JP7.5 R8.2 142.24,17.78 v109.22,17.78 | v109.22,43.18 93.98,43.18 IC2.14
REC_6  (via drill 0.35)
  Top 0.305: R7.2 142.24,2.54 106.68,2.54 v106.68,45.72
  Bottom 0.305: R7.2 JP8.5 | IC2.15 96.52,45.72 v106.68,45.72
RST
  Bottom 0.305: JP1.5 R1.1 27.94,27.94 27.94,22.86 33.02,22.86 33.02,40.64 IC1.1
SCK  (via drill 0.35)
  Top 0.305: v20.32,25.4 v20.32,43.18
  Bottom 0.305: JP1.3 v20.32,25.4 | v20.32,43.18 IC1.19
TIME  (via drill 0.35)
  Top 0.305: v22.86,81.28 55.88,81.28 v55.88,78.74
  Bottom 0.305: IC4.5 50.8,73.66 55.88,73.66 IC4.3 v55.88,78.74 | IC1.11 v22.86,81.28
TRIG  (via drill 0.35)
  Top 0.305: v38.1,86.36 v38.1,96.52 | v81.28,96.52 v81.28,76.2
  Bottom 0.305: IC1.7 38.1,55.88 v38.1,86.36 | v38.1,96.52 58.42,96.52 | 58.42,96.52 IC8.2 | IC6.6 v81.28,76.2 | v81.28,96.52 58.42,96.52
TRIG_1
  Bottom 0.305: JP3.2 101.6,88.9 101.6,86.36 IC6.15
TRIG_2
  Bottom 0.305: JP4.2 127,73.66 127,83.82 IC6.14
TRIG_3  (via drill 0.35)
  Top 0.305: v127,58.42 127,81.28 v124.46,81.28
  Bottom 0.305: JP5.2 v127,58.42 | IC6.13 v124.46,81.28
TRIG_4  (via drill 0.35)
  Top 0.305: v114.3,78.74 v114.3,43.18
  Bottom 0.305: IC6.12 v114.3,78.74 | v114.3,43.18 JP6.2
TRIG_5  (via drill 0.35)
  Top 0.305: v116.84,27.94 v116.84,76.2
  Bottom 0.305: v116.84,76.2 IC6.11 | JP7.2 v116.84,27.94
TRIG_6  (via drill 0.35)
  Top 0.305: v121.92,12.7 v121.92,73.66
  Bottom 0.305: JP8.2 v121.92,12.7 | IC6.10 v121.92,73.66
UART_RX
  Bottom 0.305: IC1.2 35.56,43.18 35.56,15.24 30.48,15.24 JP2.3
UART_TX  (via drill 0.35)
  Top 0.305: v38.1,17.78 v27.94,17.78
  Bottom 0.305: IC1.3 38.1,45.72 v38.1,17.78 | JP2.2 v27.94,17.78
VCC  (via drill 0.35)
  Top 0.305: v25.4,35.56 27.94,35.56 v27.94,20.32 | v60.96,63.5 v60.96,53.34 | v71.12,43.18 v71.12,17.78 | v66.04,83.82 v66.04,68.58
  Bottom 0.305: JP1.2 15.24,20.32 22.86,20.32 | 22.86,20.32 R1.2 v27.94,20.32 | IC1.20 C3.1 25.4,38.1 v25.4,35.56 | IC8.14 C8.1 | JP2.4 33.02,10.16 | 33.02,10.16 22.86,10.16 22.86,20.32 | C9.1 IC7.14 58.42,10.16 33.02,10.16 | 60.96,48.26 IC5.8 55.88,50.8 48.26,50.8 IC5.4 | 60.96,48.26 R2.2 60.96,43.18 v71.12,43.18 | v60.96,63.5 IC4.14 C7.1 v66.04,68.58 | v60.96,53.34 60.96,48.26 | 147.32,15.24 JP8.1 106.68,15.24 106.68,17.78 C11.1 IC3.16 | 147.32,15.24 147.32,30.48 | 147.32,30.48 147.32,45.72 | 147.32,45.72 147.32,60.96 | 147.32,60.96 JP5.1 | 147.32,45.72 JP6.1 124.46,45.72 124.46,48.26 C10.1 IC2.16 | JP7.1 147.32,30.48 | JP4.1 147.32,76.2 | 147.32,76.2 147.32,60.96 | 147.32,76.2 147.32,91.44 JP3.1 C6.1 IC6.16 | C9.1 60.96,10.16 86.36,10.16 86.36,2.54 147.32,2.54 147.32,15.24 | C8.1 v63.5,86.36 | C9.1 v71.12,17.78 | C8.1 v66.04,83.82